# EAGLE design Adafruit GUVA UV Sensor Breakout (EAGLE 6.3)
COMPANY: ADAFRUIT INDUSTRIES; REV: A
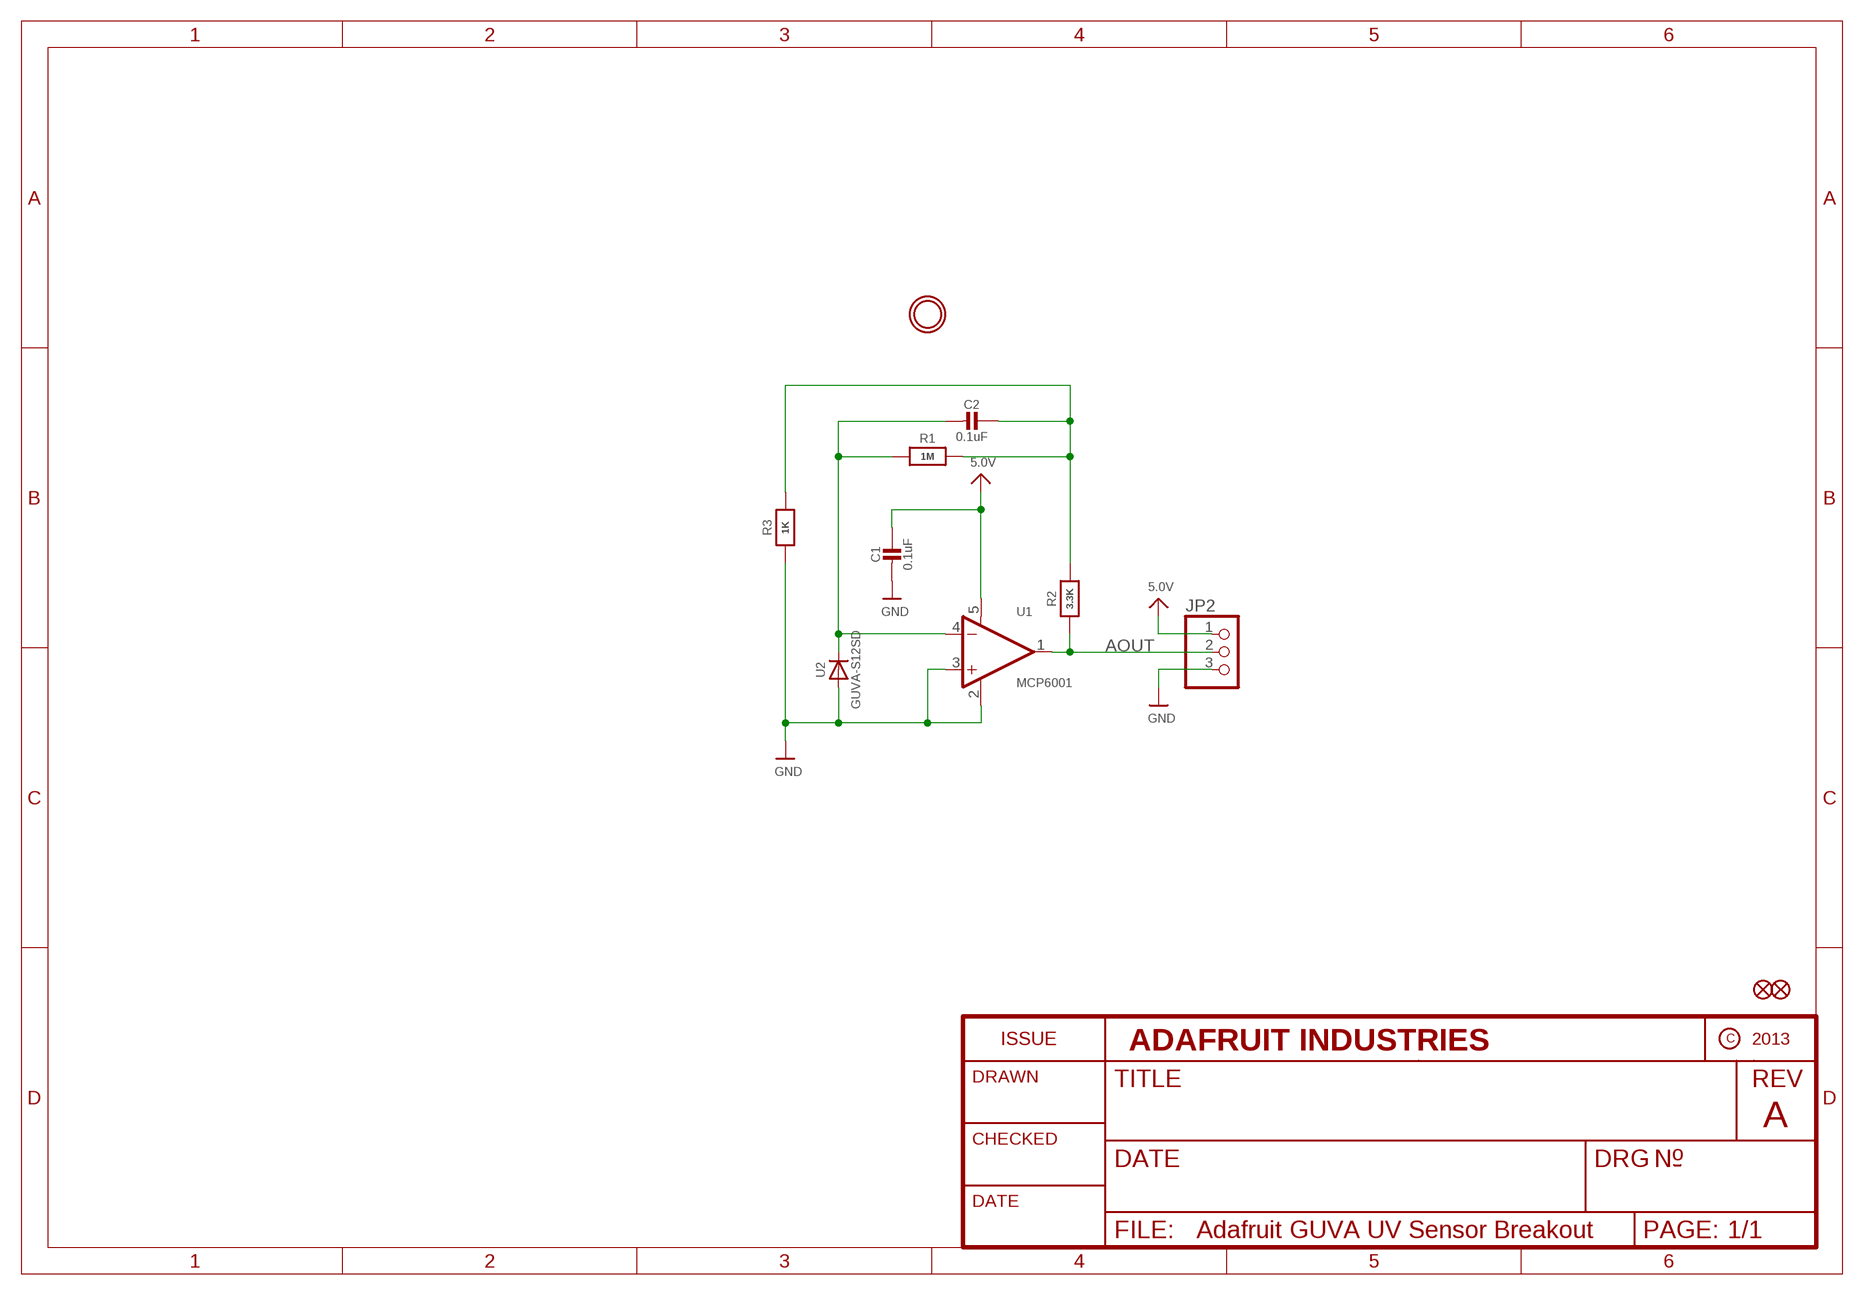
[diagram p0: schematic, sheet 1]

## Parts
C1  0.1uF  CAP_CERAMIC0805-NOOUTLINE  [0805-NO]
C2  0.1uF  CAP_CERAMIC0805-NOOUTLINE  [0805-NO]
FID1  FIDUCIAL""  [FIDUCIAL_1MM]
FID2  FIDUCIAL""  [FIDUCIAL_1MM]
JP2  PINHD-1X3CB  [1X03-CLEANBIG]
R1  1M  RESISTOR0805_NOOUTLINE  [0805-NO]
R2  3.3K  RESISTOR0805_NOOUTLINE  [0805-NO]
R3  1K  RESISTOR0805_NOOUTLINE  [0805-NO]
U1  MCP6001  OPAMP_SINGLESOT235  [SOT23-5]
U2  GUVA-S12SD  UV_GUVA-S12SD  [GUVA-S12SD]
U$6  MOUNTINGHOLE2.5  [MOUNTINGHOLE_2.5_PLATED]

## Nets
5.0V: C1.1 JP2.1 U1.5(V+)
AOUT: JP2.2 R2.1 U1.1(OUT)
GND: C1.2 JP2.3 R3.1 U1.2(V-) U1.3(+IN) U2.A
N$1: C2.1 R1.2 R2.2 R3.2
N$2: C2.2 R1.1 U1.4(-IN) U2.K(C)

## Library data of the parts
C1 C2 = microbuilder:CAP_CERAMIC: Ceramic Capacitors For new designs, use the packages preceded by an '_' character since they are more reliable: The following footprints should be used on most boards: _0402 - Standard footprint for regular board layouts _0603 - Standard footprint for regular board layouts _0805 - Standard footprint for regular board layouts _1206 - Standard footprint for regular board layouts For extremely tight-pitch boards where space is at a premium, the following 'micro-pitch' footprints can be used (smaller pads, no silkscreen outline, etc.): _0402MP - Micro-pitch footprint for very dense/compact boards _0603MP - Micro-pitch footprint for very dense/compact boards _0805MP - Micro-pitch footprint for very dense/compact boards _1206MP - Micro-pitch footprint for very dense/compact boards
FID1 FID2 = microbuilder:FIDUCIAL: Fiducial Alignment Points Various fiducial points for machine vision alignment.; BOM: EXCLUDE
JP2 = adafruit:PINHD-1X3: PIN HEADER
R1-R3 = microbuilder:RESISTOR: Resistors For new designs, use the packages preceded by an '_' character since they are more reliable: The following footprints should be used on most boards: _0402 - Standard footprint for regular board layouts _0603 - Standard footprint for regular board layouts _0805 - Standard footprint for regular board layouts _1206 - Standard footprint for regular board layouts For extremely tight-pitch boards where space is at a premium, the following 'micro-pitch' footprints can be used (smaller pads, no silkscreen outline, etc.): _0402MP - Micro-pitch footprint for very dense/compact boards _0603MP - Micro-pitch footprint for very dense/compact boards _0805MP - Micro-pitch footprint for very dense/compact boards _1206MP - Micro-pitch footprint for very dense/compact boards
U1 = microbuilder:OPAMP_SINGLE: Single-Output Op-Amp SOT363 (6-TSSOP) Manuf. ID Slew Rate Gain Bandwidth Prod. -3dB Bandwidth Current Input Bias Voltage Input Offset Supply - Single Supply - Dual Digikey Mouser LMV341MG/NOPB 1V/µs 1MHz -- 0.02pA 25µV 2.4-5.5V LMV341MGTR-ND 926-LMV341MG/NOPB LMH6601MG/NOPB 275V/µs 155MHz 250MHz 5pA 1000µV 2.4-5.5V +/-1.2-2.75V LMH6601MGCT-ND 926-LMH6601MG/NOPB
U2 = microbuilder:UV_GUVA-S12SD: UV Sensor - GUVA-S12SD 240-370nm detection range
U$6 = microbuilder:MOUNTINGHOLE: Mounting Hole For #2 screws (0.086"/2.18mm width, 0.094"/2.4mm hole) use 2.5mm; BOM: EXCLUDE

## Board
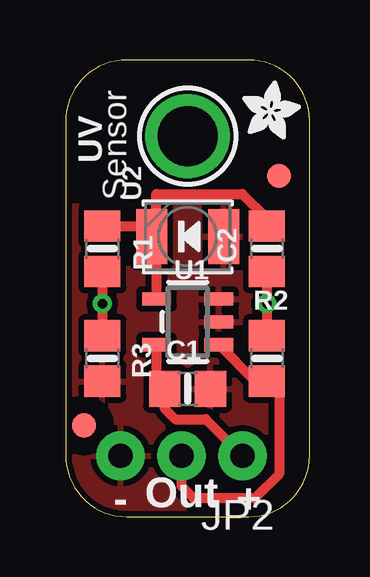
[diagram p1: board, top side]
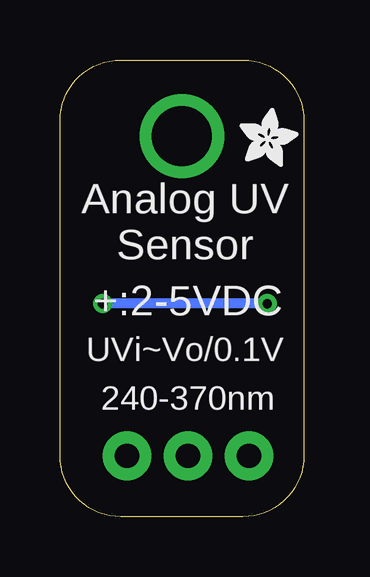
[diagram p2: board, bottom side, seen from below]

Size 10.16 x 19.05 mm. Coordinates in mm from the lower left corner, seen from the top.
Outline: 2.54,0 7.62,0 arc90 10.16,2.54 10.16,16.51 arc90 7.62,19.05 2.54,19.05 arc90 0,16.51 0,2.54 arc90 2.54,0
Copper layers (1*16): Top 0.035mm / dielectric 1.5mm / Bottom 0.035mm
Design rules "adafruit *": minimum track width 8mil, minimum drill 15.5mil, track to track 8mil, track to pad 8mil, pad to pad 8mil, via to via 8mil, smd to smd 8mil, copper to edge 10mil, drill to drill 8mil, minimum pad ring 20mil, minimum via ring 8mil, stop-mask expansion 2mil, vias tented up to drill 20mil, thermal gap 10mil

### Footprints (pad centres in the part's own frame; a part is rotated, then mirrored left to right if it is on the bottom)
0805-NO = smd 1.3 x 1.5: 1 -0.95,0; 2 0.95,0
FIDUCIAL_1MM = smd 1 x 1: 1 0,0
1X03-CLEANBIG = drill 1.016 pad 1.676: 1 -2.54,0; 2 0,0; 3 2.54,0
SOT23-5 = smd 0.55 x 1.2: 1 -0.95,-1.3; 2 0,-1.3; 3 0.95,-1.3; 4 0.95,1.3; 5 -0.95,1.3
GUVA-S12SD = smd 2.3 x 1.3: A 0,-1.5; K 0,1.5
MOUNTINGHOLE_2.5_PLATED = drill 2.5 pad 3.2: P$1 0,0

### Placement (x,y rotation side)
C1  5.08,5.33 0 top
C2  8.38,11.18 90 top
FID1  0.76,3.81 90 top
FID2  8.89,14.22 90 top
JP2  4.83,2.54 180 top
R1  1.52,11.18 270 top
R2  8.38,6.6 90 top
R3  1.52,6.6 90 top
U1  5.08,8.13 90 top
U2  5.08,11.68 90 top
U$6  5.08,15.88 0 top
U$7  [ADAFRUIT_2.5MM]  7.37,15.75 0 top
U$8  [ADAFRUIT_2.5MM]  2.67,14.61 0 bottom

### Tracks (layer width: path | path; a pad name or v marks a point on that pad's centre or on a via)
5.0V
  Top 0.406: U1.5 3.78,5.68 C1.1 4.13,4.51 4.57,4.06 5.84,4.06 JP2.1
AOUT
  Top 0.406: U1.1 7.9,5.65 R2.1 8.89,5.15 8.89,1.78 7.87,0.76 5.33,0.76 4.83,1.27 JP2.2
GND
  pour Top (isolate 0.254): 0,0 0,12.95 10.16,12.95 10.16,0
N$1  (via drill 0.39)
  Top 0.406: R3.2 v1.52,8.89 R1.2 | C2.1 v8.38,8.89 R2.2
  Bottom 0.406: v1.52,8.89 v8.38,8.89
N$2
  Top 0.406: R1.1 3.58,12.13 U2.K 3.78,11.68 | 3.78,11.68 U1.4 | 3.78,11.68 3.78,13.46 7.37,13.46 8.38,12.45 C2.2

### Text on the board
tPlace: UV | Sensor | - | Out | +
bPlace: Analog UV / Sensor | +:2-5VDC | UVi~Vo/0.1V | 240-370nm